# Altium schematic sheet MCU063A_Power.SchDoc
size 431 x 279 mm; Date: Not shown in title block; ApprovedBy: Not shown in title block; CheckedBy: Not shown in title block; Author: Not shown in title block; CompanyName: Not shown in title block; DrawnBy: Cody Watkins; Engineer: Not shown in title block; Organization: Not shown in title block; Address1: Not shown in title block; Address2: Not shown in title block; Address3: Not shown in title block; Address4: Not shown in title block; DocumentNumber: 5; Revision: Use project parameter SCH_Rev; SheetNumber: 5; SheetTotal: 11; PageSetup: Record=PageOptions|CenterHorizontal=True|CenterVertical=True|PrintScale=1.00|XCorrection=1.00|YCorrection=1.00|PrintKind=0|BorderSize=5000000|LeftOffset=0|BottomOffset=0|Orientation=2|PaperLength=1000|PaperWidth=1000|Scale=100|PaperSource=15|PrintQuality=600|MediaType=1|DitherType=10|PaperKind=Letter|PrintScaleMode=1; CurrentTime: Not shown in title block; CurrentDate: Not shown in title block; Time: Not shown in title block; DocumentFullPathAndName: Not shown in title block; DocumentName: Not shown in title block; ModifiedDate: Not shown in title block; ImagePath: Not shown in title block
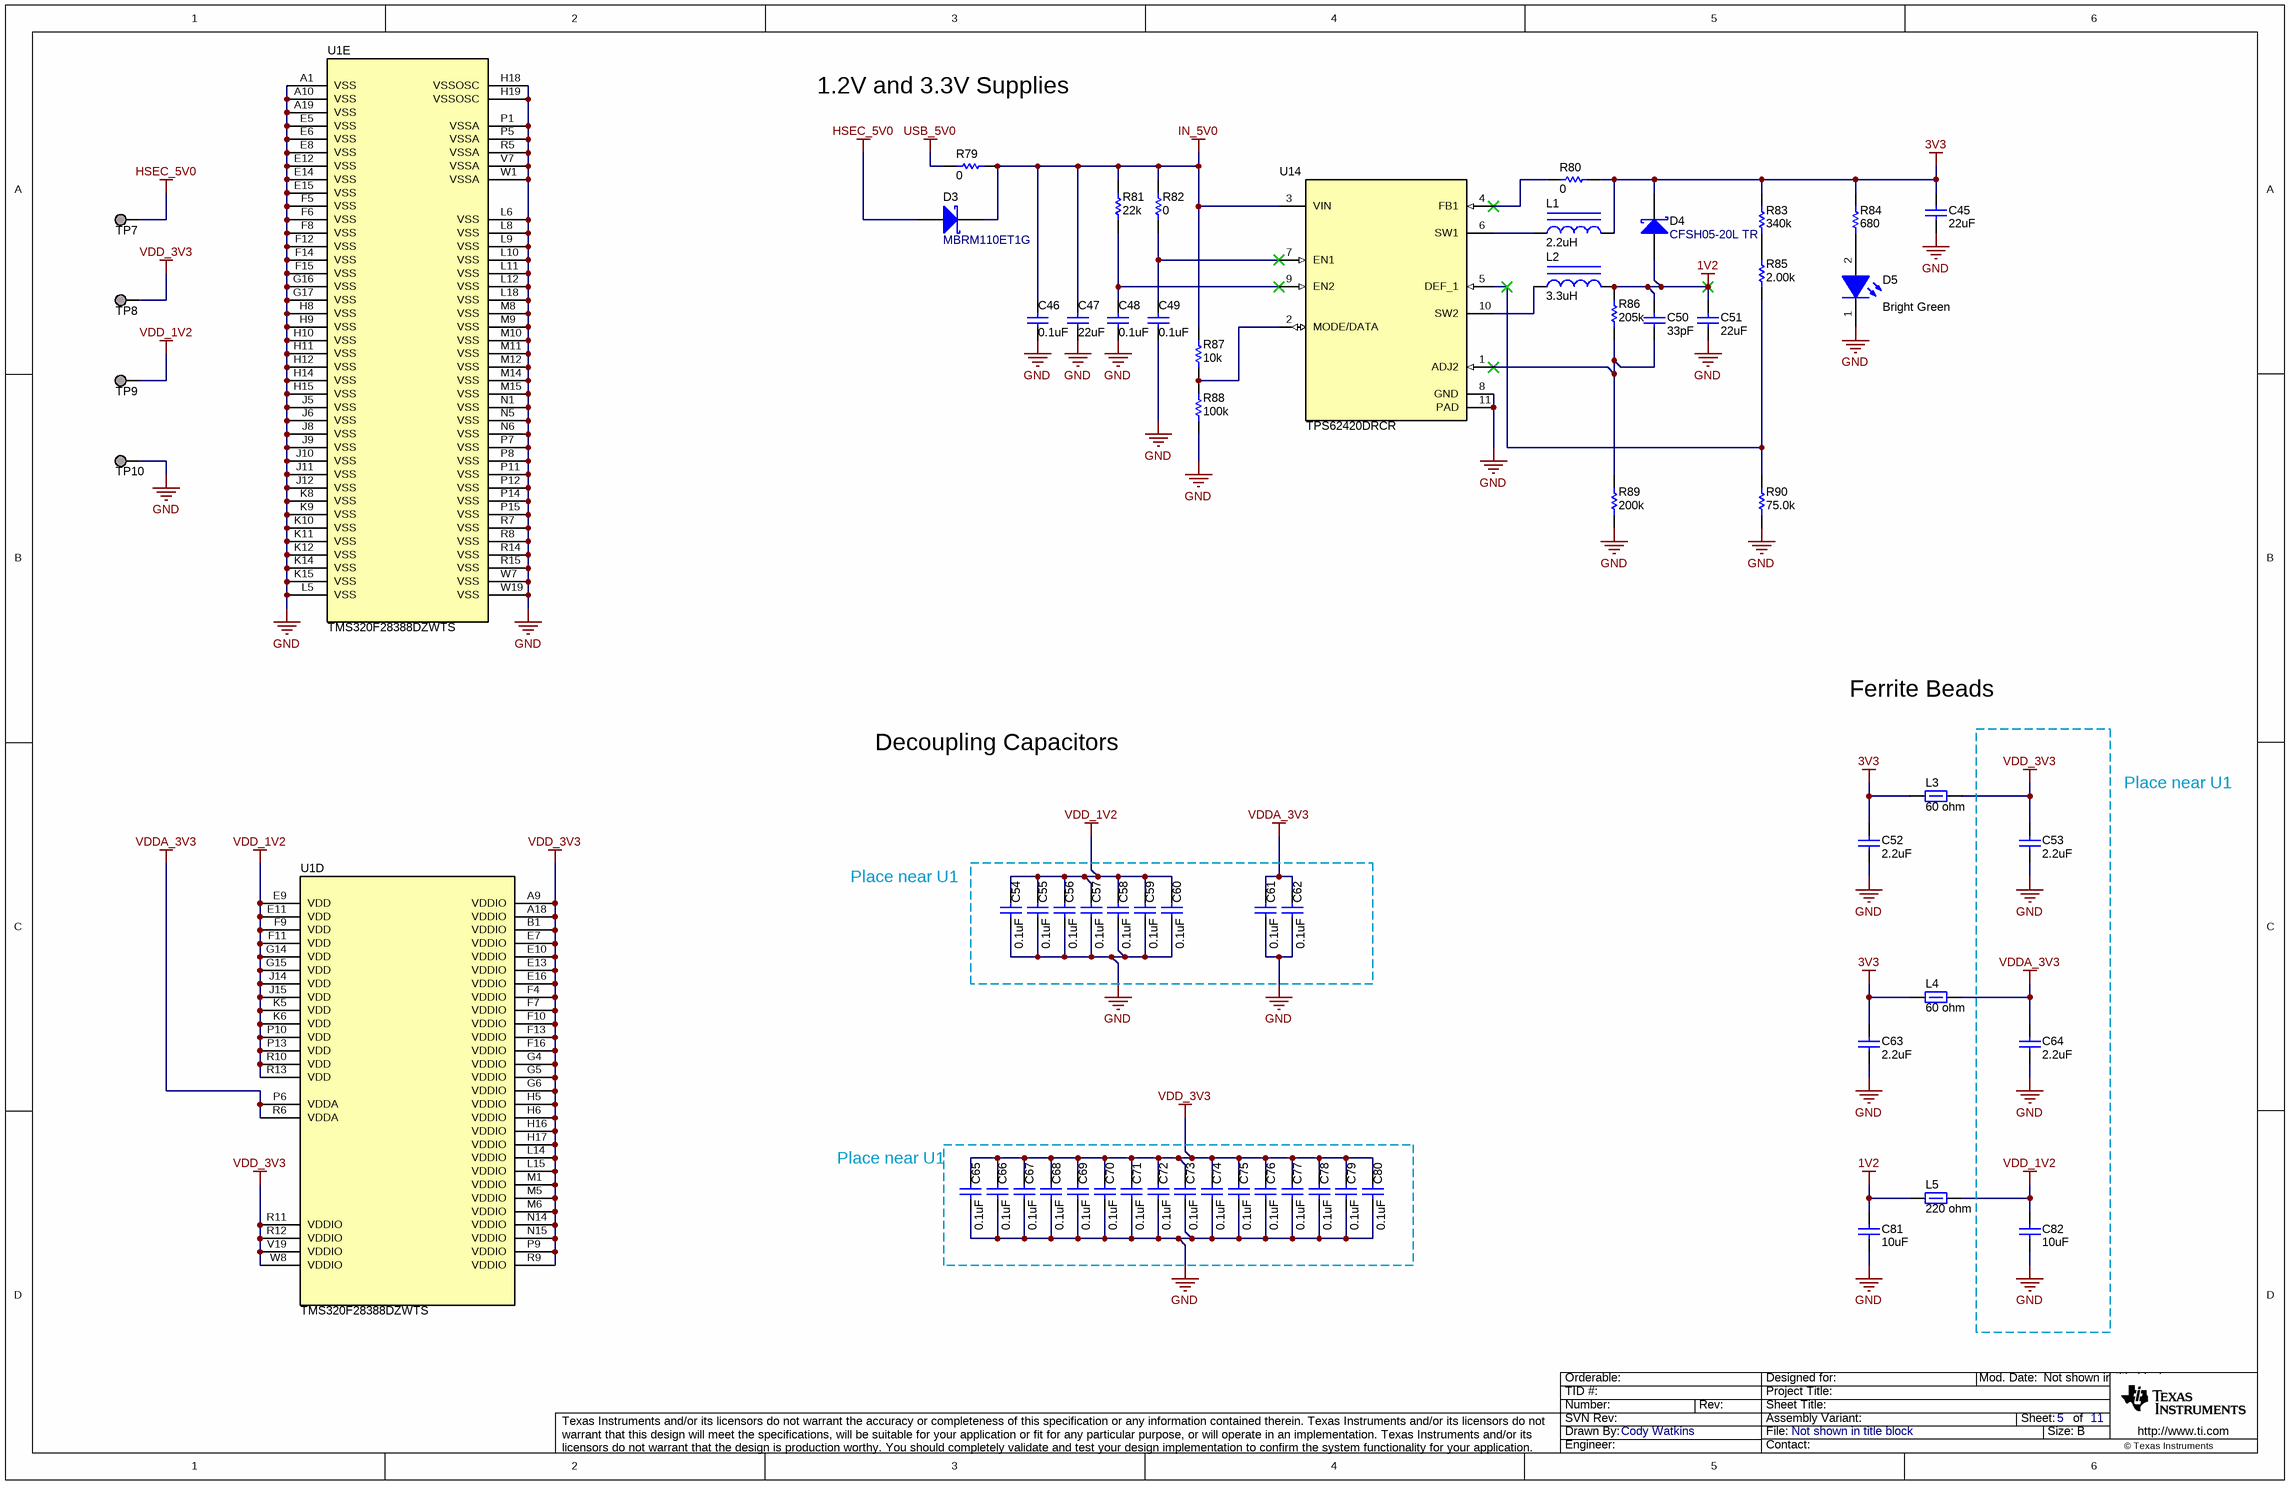
[diagram p0: MCU063A_Power.SchDoc]

## Parts
C45  ValueDisplayed: 22uF  [0805_HV]  (hidden comment: GRM21BR61C226ME44L)
C46  ValueDisplayed: 0.1uF  [0402]  (hidden comment: 0402YC104KAT2A)
C47  ValueDisplayed: 22uF  [0805_HV]  (hidden comment: GRM21BR61C226ME44L)
C48  ValueDisplayed: 0.1uF  [0402]  (hidden comment: 0402YC104KAT2A)
C49  ValueDisplayed: 0.1uF  [0402]  (hidden comment: 0402YC104KAT2A)
C50  ValueDisplayed: 33pF  [0402]  (hidden comment: 885012005043)
C51  ValueDisplayed: 22uF  [0805_HV]  (hidden comment: GRM21BR61C226ME44L)
C52  ValueDisplayed: 2.2uF  [0603]  (hidden comment: C0603C225K8PACTU)
C53  ValueDisplayed: 2.2uF  [0603]  (hidden comment: C0603C225K8PACTU)
C54  ValueDisplayed: 0.1uF  [0402]  (hidden comment: 0402YC104KAT2A)
C55  ValueDisplayed: 0.1uF  [0402]  (hidden comment: 0402YC104KAT2A)
C56  ValueDisplayed: 0.1uF  [0402L]  (hidden comment: 0402YC104KAT2A)
C57  ValueDisplayed: 0.1uF  [0402]  (hidden comment: 0402YC104KAT2A)
C58  ValueDisplayed: 0.1uF  [0402]  (hidden comment: 0402YC104KAT2A)
C59  ValueDisplayed: 0.1uF  [0402]  (hidden comment: 0402YC104KAT2A)
C60  ValueDisplayed: 0.1uF  [0402]  (hidden comment: 0402YC104KAT2A)
C61  ValueDisplayed: 0.1uF  [0402]  (hidden comment: 0402YC104KAT2A)
C62  ValueDisplayed: 0.1uF  [0402L]  (hidden comment: 0402YC104KAT2A)
C63  ValueDisplayed: 2.2uF  [0603]  (hidden comment: C0603C225K8PACTU)
C64  ValueDisplayed: 2.2uF  [0603]  (hidden comment: C0603C225K8PACTU)
C65  ValueDisplayed: 0.1uF  [0402]  (hidden comment: 0402YC104KAT2A)
C66  ValueDisplayed: 0.1uF  [0402]  (hidden comment: 0402YC104KAT2A)
C67  ValueDisplayed: 0.1uF  [0402]  (hidden comment: 0402YC104KAT2A)
C68  ValueDisplayed: 0.1uF  [0402]  (hidden comment: 0402YC104KAT2A)
C69  ValueDisplayed: 0.1uF  [0402]  (hidden comment: 0402YC104KAT2A)
C70  ValueDisplayed: 0.1uF  [0402]  (hidden comment: 0402YC104KAT2A)
C71  ValueDisplayed: 0.1uF  [0402]  (hidden comment: 0402YC104KAT2A)
C72  ValueDisplayed: 0.1uF  [0402]  (hidden comment: 0402YC104KAT2A)
C73  ValueDisplayed: 0.1uF  [0402]  (hidden comment: 0402YC104KAT2A)
C74  ValueDisplayed: 0.1uF  [0402]  (hidden comment: 0402YC104KAT2A)
C75  ValueDisplayed: 0.1uF  [0402]  (hidden comment: 0402YC104KAT2A)
C76  ValueDisplayed: 0.1uF  [0402]  (hidden comment: 0402YC104KAT2A)
C77  ValueDisplayed: 0.1uF  [0402]  (hidden comment: 0402YC104KAT2A)
C78  ValueDisplayed: 0.1uF  [0402]  (hidden comment: 0402YC104KAT2A)
C79  ValueDisplayed: 0.1uF  [0402]  (hidden comment: 0402YC104KAT2A)
C80  ValueDisplayed: 0.1uF  [0402]  (hidden comment: 0402YC104KAT2A)
C81  ValueDisplayed: 10uF  [0805_HV]  (hidden comment: C0805C106K8PACTU)
C82  ValueDisplayed: 10uF  [0603]  (hidden comment: GRM188R61A106ME69D)
D3  MBRM110ET1G  [POWERMITE]
D4  CFSH05-20L TR  [SOD-882L]
D5  value Bright Green  [WL-SMCW_Green_0805]  (hidden comment: 150080VS75000)
L1  ValueDisplayed: 2.2uH  [PFL3215]  (hidden comment: PFL3215-222MEB)
L2  ValueDisplayed: 3.3uH  [WE-MAIA_2510]  (hidden comment: 78438323033)
L3  value 60 ohm  [0805_HV]  (hidden comment: BKP2125HS600-T)
L4  value 60 ohm  [0805_HV]  (hidden comment: BKP2125HS600-T)
L5  value 220 ohm  [0805_HV]  (hidden comment: BLM21PG221SN1D)
R79  ValueDisplayed: 0  [0805_HV]  (hidden comment: MCR10EZPJ000)
R80  ValueDisplayed: 0  [0402]  (hidden comment: CRCW04020000Z0ED)
R81  ValueDisplayed: 22k  [0402]  (hidden comment: CRCW040222K0JNED)
R82  ValueDisplayed: 0  [0805_HV]  (hidden comment: MCR10EZPJ000)
R83  ValueDisplayed: 340k  [0402]  (hidden comment: CRCW0402340KFKED)
R84  ValueDisplayed: 680  [0402]  (hidden comment: CRCW0402680RJNED)
R85  ValueDisplayed: 2.00k  [0402]  (hidden comment: ERJ-2RKF2001X)
R86  ValueDisplayed: 205k  [0402]  (hidden comment: CRCW0402205KFKED)
R87  ValueDisplayed: 10k  [0402]  (hidden comment: CRCW040210K0JNED)
R88  ValueDisplayed: 100k  [0603]  (hidden comment: CRCW0603100KJNEA)
R89  ValueDisplayed: 200k  [0402]  (hidden comment: ERJ-2RKF2003X)
R90  ValueDisplayed: 75.0k  [0603]  (hidden comment: RT0603DRE0775KL)
TP7  TESTPOINT  [TP_50MIL-25MILHOLE]  (value not drawn)  (no BOM)
TP8  TESTPOINT  [TP_50MIL-25MILHOLE]  (value not drawn)  (no BOM)
TP9  TESTPOINT  [TP_50MIL-25MILHOLE]  (value not drawn)  (no BOM)
TP10  TESTPOINT  [TP_50MIL-25MILHOLE]  (value not drawn)  (no BOM)
U1  TMS320F28388DZWTS  [ZWT0337A]  (parts D,E of 5)
U14  TPS62420DRCR  [DRC0010J]

## Nets
1V2: C50.1 C51.1 C81.2 D4.2(A) L2.2 L5.1 R86.2
3V3: C45.1 C52.2 C63.2 D4.1(K) L1.2 L3.1 L4.1 R80.1 R83.2 R84.2
GND: C45.2 C46.2 C47.2 C48.2 C49.1 C51.2 C52.1 C53.1 C54.2 C55.2 C56.2 C57.2 C58.2 C59.2 C60.2 C61.2 C62.2 C63.1 C64.1 C65.2 C66.2 C67.2 C68.2 C69.2 C70.2 C71.2 C72.2 C73.2 C74.2 C75.2 C76.2 C77.2 C78.2 C79.2 C80.2 C81.1 C82.2 D5.1(K) R88.1 R89.1 R90.1 TP10.1 U1.A1(VSS) U1.A10(VSS) U1.A19(VSS) U1.E5(VSS) U1.E6(VSS) U1.E8(VSS) U1.E12(VSS) U1.E14(VSS) U1.E15(VSS) U1.F5(VSS) U1.F6(VSS) U1.F8(VSS) U1.F12(VSS) U1.F14(VSS) U1.F15(VSS) U1.G16(VSS) U1.G17(VSS) U1.H8(VSS) U1.H9(VSS) U1.H10(VSS) U1.H11(VSS) U1.H12(VSS) U1.H14(VSS) U1.H15(VSS) U1.H18(VSSOSC) U1.H19(VSSOSC) U1.J5(VSS) U1.J6(VSS) U1.J8(VSS) U1.J9(VSS) U1.J10(VSS) U1.J11(VSS) U1.J12(VSS) U1.K8(VSS) U1.K9(VSS) U1.K10(VSS) U1.K11(VSS) U1.K12(VSS) U1.K14(VSS) U1.K15(VSS) U1.L5(VSS) U1.L6(VSS) U1.L8(VSS) U1.L9(VSS) U1.L10(VSS) U1.L11(VSS) U1.L12(VSS) U1.L18(VSS) U1.M8(VSS) U1.M9(VSS) U1.M10(VSS) U1.M11(VSS) U1.M12(VSS) U1.M14(VSS) U1.M15(VSS) U1.N1(VSS) U1.N5(VSS) U1.N6(VSS) U1.P1(VSSA) U1.P5(VSSA) U1.P7(VSS) U1.P8(VSS) U1.P11(VSS) U1.P12(VSS) U1.P14(VSS) U1.P15(VSS) U1.R5(VSSA) U1.R7(VSS) U1.R8(VSS) U1.R14(VSS) U1.R15(VSS) U1.V7(VSSA) U1.W1(VSSA) U1.W7(VSS) U1.W19(VSS) U14.8(GND) U14.11(PAD)
HSEC_5V0: D3.2(A) TP7.1
IN_5V0: C46.1 C47.1 D3.1(K) R79.1 R81.2 R82.1 R87.2 U14.3(VIN)
USB_5V0: R79.2
VDD_1V2: C54.1 C55.1 C56.1 C57.1 C58.1 C59.1 C60.1 C82.1 L5.2 TP9.1 U1.E9(VDD) U1.E11(VDD) U1.F9(VDD) U1.F11(VDD) U1.G14(VDD) U1.G15(VDD) U1.J14(VDD) U1.J15(VDD) U1.K5(VDD) U1.K6(VDD) U1.P10(VDD) U1.P13(VDD) U1.R10(VDD) U1.R13(VDD)
VDD_3V3: C53.2 C65.1 C66.1 C67.1 C68.1 C69.1 C70.1 C71.1 C72.1 C73.1 C74.1 C75.1 C76.1 C77.1 C78.1 C79.1 C80.1 L3.2 TP8.1 U1.A9(VDDIO) U1.A18(VDDIO) U1.B1(VDDIO) U1.E7(VDDIO) U1.E10(VDDIO) U1.E13(VDDIO) U1.E16(VDDIO) U1.F4(VDDIO) U1.F7(VDDIO) U1.F10(VDDIO) U1.F13(VDDIO) U1.F16(VDDIO) U1.G4(VDDIO) U1.G5(VDDIO) U1.G6(VDDIO) U1.H5(VDDIO) U1.H6(VDDIO) U1.H16(VDDIO) U1.H17(VDDIO) U1.L14(VDDIO) U1.L15(VDDIO) U1.M1(VDDIO) U1.M5(VDDIO) U1.M6(VDDIO) U1.N14(VDDIO) U1.N15(VDDIO) U1.P9(VDDIO) U1.R9(VDDIO) U1.R11(VDDIO) U1.R12(VDDIO) U1.V19(VDDIO) U1.W8(VDDIO)
VDDA_3V3: C61.1 C62.1 C64.2 L4.2 U1.P6(VDDA) U1.R6(VDDA)
NetC48_1: C48.1 R81.1 U14.9(EN2)
NetC49_2: C49.2 R82.2 U14.7(EN1)
NetC50_2: C50.2 R86.1 R89.2 U14.1(ADJ2)
NetD5_2: D5.2(A) R84.1
NetL1_1: L1.1 U14.6(SW1)
NetL2_1: L2.1 U14.10(SW2)
NetR80_2: R80.2 U14.4(FB1)
NetR83_1: R83.1 R85.2
NetR85_1: R85.1 R90.2 U14.5(DEF_1)
NetR87_1: R87.1 R88.2 U14.2(MODE/DATA)

## Notes on the sheet
- 1.2V and 3.3V Supplies
- Ferrite Beads
- Decoupling Capacitors
- Place near U1
- (near C65) Place near U1
- Drawn By:
- SVN Rev:
- Number:
- TID #:
- Orderable:
- Rev:
- Sheet Title:
- File:
- Project Title:
- Designed for:
- Assembly Variant:
- Mod. Date:
- Sheet:
- Size:
- of
- B
- http://www.ti.com
- Texas Instruments and/or its licensors do not warrant the accuracy or completeness of this specification or any information contained therein. Texas Instruments and/or its licensors do not warrant that this design will meet the specifications, will be suitable for your application or fit for any particular purpose, or will operate in an implementation. Texas Instruments and/or its licensors do not warrant that the design is production worthy. You should completely validate and test your design implementation to confirm the system functionality for your application.
- Engineer:
- Contact:
- © Texas Instruments

## Library data of the parts
C45 C47 C51 = CMP-0008294-2: CAP, CERM, 22 uF, 16 V, +/- 20%, X5R, 0805; Manufacturer: MuRata; TaMin_C: -55°C; Polarized: N; SizeAreaWB_mm2: 6.75; Value1: Unknown; U/M: EA; Value: 22uF; TaMax_C: 85°C; SizeZ_mm: 1.45; SizeX_mm: 2; SizeY_mm: 1.25; Cap_Case: 0805; Value2: 16V; SizeArea_mm2: 2.5; Cap_F: 22µF; AEC Category: Q200; Supplier Part Number 2: 81-GRM21BR61C226ME4L; Publisher: Texas Instruments; Supplier 2: Mouser; TempCo: X5R; Published: 2008-06-19; RoHS: Y; MountType: SMT; Supplier 1: Digi-Key; PackageReference: 0805; Tolerance_%: 20%; CompType: Capacitor; LatestRevisionDate: 2017-03-09; PartNumber: GRM21BR61C226ME44L; AEC Qualified: N; ComponentLink1Description: Datasheet link; AEC Grade: N/A; Supplier Part Number 1: 490-10747-1-ND; Technology: Ceramic; ComponentLink1URL: http://search.murata.co.jp/Ceramy/image/img/A01X/G101/ENG/GRM21BR61C226ME44-01.pdf
C46 C48 C49 C54 C55 C57-C61 C65-C80 = CMP-0006201-2: CAP, CERM, 0.1 uF, 16 V, +/- 10%, X7R, 0402; Manufacturer: AVX; TaMin_C: -55°C; Polarized: N; SizeAreaWB_mm2: 3; Value1: Unknown; U/M: EA; Value: 0.1uF; TaMax_C: 125°C; SizeZ_mm: 0.6; SizeX_mm: 1; SizeY_mm: 0.5; Value2: 16V; Cap_F: 100nF; AEC Category: Q200; Supplier Part Number 2: 09R7024; Publisher: Texas Instruments; Supplier 2: Newark; Supplier Part Number 3: 581-0402YC104KAT2A; TempCo: X7R; Supplier 3: Mouser; Published: 2008-06-19; RoHS: Y; MountType: SMT; Supplier 1: Digi-Key; PackageReference: 0402; Tolerance_%: 10%; Cap_Case: 0402; SizeArea_mm2: 0.5; CompType: Capacitor; LatestRevisionDate: 2017-03-09; PartNumber: 0402YC104KAT2A; AEC Qualified: N; ComponentLink1Description: Datasheet link; AEC Grade: N/A; Supplier Part Number 1: 478-7888-1-ND; Technology: Ceramic; ComponentLink1URL: http://catalogs.avx.com/SurfaceMount.pdf
C50 = CMP-0006213-2: CAP, CERM, 33 pF, 25 V, +/- 5%, C0G/NP0, 0402; Manufacturer: Wurth Elektronik; TaMin_C: -55°C; Polarized: N; SizeAreaWB_mm2: 3; Value1: Unknown; U/M: EA; Value: 33pF; TaMax_C: 125°C; SizeZ_mm: 0.6; SizeX_mm: 1; SizeY_mm: 0.5; Value2: 25V; AEC Category: Q200; Publisher: Texas Instruments; TempCo: C0G/NP0; Published: 2008-06-19; RoHS: Y; MountType: SMT; Supplier 1: Mouser; PackageReference: 0402; Tolerance_%: 5%; Cap_Case: 0402; SizeArea_mm2: 0.5; CompType: Capacitor; LatestRevisionDate: 2017-03-09; PartNumber: 885012005043; AEC Qualified: N; Cap_F: 33pF; ComponentLink1Description: Datasheet link; Supplier Part Number 1: 710-885012005043; Technology: Ceramic; ComponentLink1URL: http://katalog.we-online.de/pbs/datasheet/885012005043.pdf; AEC Grade: N/A; VDC_V: 25V
C52 C53 C63 C64 = CMP-0006906-5: CAP, CERM, 2.2 uF, 10 V, +/- 10%, X5R, 0603; Manufacturer: Kemet; TaMin_C: -55°C; Polarized: N; SizeAreaWB_mm2: 4.68; Value1: Unknown; U/M: EA; Value: 2.2uF; TaMax_C: 85°C; SizeZ_mm: 1; SizeX_mm: 1.6; SizeY_mm: 0.8; Value2: 10V; SizeArea_mm2: 1.28; Cap_F: 2.2µF; AEC Category: Q200; Supplier Part Number 2: 80-C0603C225K8P; Publisher: Texas Instruments; Supplier 2: Mouser; Supplier Part Number 3: 1108322; TempCo: X5R; Supplier 3: Farnell; Published: 2008-06-19; RoHS: Y; MountType: SMT; Supplier 1: Digi-Key; PackageReference: 0603; Tolerance_%: 10%; Cap_Case: 0603; CompType: Capacitor; LatestRevisionDate: 2017-03-09; PartNumber: C0603C225K8PACTU; AEC Qualified: ?; ComponentLink1Description: Datasheet link; Supplier Part Number 1: 399-4911-1-ND; Technology: Ceramic; ComponentLink1URL: http://www.kemet.com/kemet/web/homepage/kechome.nsf/vapubfiles/F3102_Y5V.pdf/$file/F3102_Y5V.pdf
C56 C62 = CMP-0006201-2: CAP, CERM, 0.1 uF, 16 V, +/- 10%, X7R, 0402; Manufacturer: AVX; TaMin_C: -55°C; Polarized: N; SizeAreaWB_mm2: 3; Value1: Unknown; U/M: EA; Value: 0.1uF; TaMax_C: 125°C; SizeZ_mm: 0.6; SizeX_mm: 1; SizeY_mm: 0.5; Cap_Case: 0402; Value2: 16V; Cap_F: 100nF; AEC Category: Q200; Supplier Part Number 2: 09R7024; Publisher: Texas Instruments; Supplier 2: Newark; Supplier Part Number 3: 581-0402YC104KAT2A; TempCo: X7R; Supplier 3: Mouser; Published: 2008-06-19; RoHS: Y; MountType: SMT; Supplier 1: Digi-Key; PackageReference: 0402; Tolerance_%: 10%; SizeArea_mm2: 0.5; CompType: Capacitor; LatestRevisionDate: 2017-03-09; PartNumber: 0402YC104KAT2A; AEC Qualified: N; ComponentLink1Description: Datasheet link; AEC Grade: N/A; Supplier Part Number 1: 478-7888-1-ND; Technology: Ceramic; ComponentLink1URL: http://catalogs.avx.com/SurfaceMount.pdf
C81 = CMP-0007732-2: CAP, CERM, 10 uF, 10 V, +/- 10%, X5R, 0805; Manufacturer: Kemet; TaMin_C: -55°C; ESR_ohm: 3m; Polarized: N; SizeAreaWB_mm2: 6.75; Value1: 0.003 ohm; U/M: EA; Value: 10uF; TaMax_C: 85°C; SizeZ_mm: 1.45; SizeX_mm: 2; SizeY_mm: 1.25; Cap_Case: 0805; Value2: 10V; SizeArea_mm2: 2.5; Cap_F: 10µF; IRMS_A: 11.43A; AEC Category: Q200; Supplier Part Number 2: 70K9138; Publisher: Texas Instruments; Supplier 2: Newark; Supplier Part Number 3: 80-C0805C106K8P; TempCo: X5R; Supplier 3: Mouser; Published: 2008-06-19; RoHS: Y; MountType: SMT; Supplier 1: Digi-Key; PackageReference: 0805; Tolerance_%: 10%; CompType: Capacitor; LatestRevisionDate: 2017-03-09; PartNumber: C0805C106K8PACTU; AEC Qualified: ?; ComponentLink1Description: Datasheet link; Supplier Part Number 1: 399-4925-1-ND; Technology: Ceramic; ComponentLink1URL: http://www.kemet.com/kemet/web/homepage/kechome.nsf/file/Partial%20Copy%20-%20Ceramic%20Surface%20Mount%20Capacitors/$file/F3102_CE.pdf
C82 = CMP-0007318-5: CAP, CERM, 10 uF, 10 V, +/- 20%, X5R, 0603; Manufacturer: MuRata; Polarized: N; Value: 10uF; U/M: EA; Cap_F: 10µF; Value1: Unknown; VDC_V: 10V; TaMin_C: -55°C; TaMax_C: 85°C; AEC Category: Q200; SizeArea_mm2: 1.28; SizeAreaWB_mm2: 4.68; SizeX_mm: 1.6; SizeY_mm: 0.8; SizeZ_mm: 1; CompType: Capacitor; PartNumber: GRM188R61A106ME69D; PackageReference: 0603; RoHS: Y; Tolerance_%: 20%; Value2: 10V; MountType: SMT; Technology: Ceramic; TempCo: X5R; Cap_Case: 0603; Published: 2008-06-19; Publisher: Texas Instruments; LatestRevisionDate: 2017-03-09; ComponentLink1Description: Datasheet link; ComponentLink1URL: http://psearch.murata.com/capacitor/product/GRM188R61A106ME69%23.pdf; AEC Qualified: ?
D3 = CMP-0028747-2: Diode, Schottky, 10 V, 1 A, AEC-Q101, POWERMITE; Manufacturer: ON Semiconductor; Vf_V: 530mV; Value: 10V; Green_REACh: Incomplete; Io_A: 1A; SizeZ_mm: 1.15; AEC Category: Q101; SizeX_mm: 3.9; AEC Qualified: Y; Value2: 0.53V; SizeAreaWB_mm2: 14.945; SizeArea_mm2: 7.995; TJmax_C: 150°C; Green_Lifecycle: Not Set; SizeY_mm: 2.05; ComponentLink1Description: Datasheet link; Vr_V: 10V; MountType: SMT; Value1: 1A; PartNumber: MBRM110ET1G; PackageReference: POWERMITE; CompType: Diode; Green_EU RoHS: Incomplete; Green_EU RoHS-2: Incomplete; ComponentLink1URL: http://www.onsemi.com/pub_link/Collateral/MBRM110E-D.PDF; RoHS: Y; Type: Schottky
D4 = CMP-0028751-2: Diode, Schottky, 20 V, 0.5 A, 1.0x0.35x0.6mm; Manufacturer: Central Semiconductor; Io_A: 500mA; Green_Lifecycle: Not Set; SizeAreaWB_mm2: 3.2; Vr_V: 20V; Green_REACh: Incomplete; Value1: 0.5A; TJmax_C: 150°C; Value: 20V; SizeZ_mm: 0.4; SizeX_mm: 1; SizeY_mm: 0.6; Vf_V: 500mV; Value2: 0.5V; AEC Qualified: N; AEC Category: Q101; ComponentLink1URL: http://www.centralsemi.com/PDFs/products/CFSH05-20L.PDF; RoHS: Y; MountType: SMT; Green_EU RoHS-2: Incomplete; Green_EU RoHS: Incomplete; PackageReference: 1.0x0.35x0.6mm; SizeArea_mm2: 0.6; CompType: Diode; Type: Schottky; PartNumber: CFSH05-20L TR; ComponentLink1Description: Datasheet link
D5 = CMP-0002960-2: LED, Bright Green, SMD; Manufacturer: Wurth Elektronik; Type: AlInGaP; Vf_V: 2V; Io_A: 20mA; Vr_V: 5V; Tjmax_C: 85°C; Power_TotalModule: 72mW; Value1: 0.072W; Angle: 140; U/M: EA; PartNumber: 150080VS75000; PackageReference: LED_0805; RoHS: Y; CompType: LED; MountType: SMT; Value2: 2V; Color: Bright Green; Published: 2008-07-11; Publisher: Texas Instruments; ComponentLink1URL: http://katalog.we-online.de/led/datasheet/150080VS75000.pdf; ComponentLink1Description: Datasheet link; LatestRevisionDate: 2017-03-09; Supplier 1: Digi-Key; Supplier Part Number 1: 732-4986-1-ND; Supplier 2: Newark; Supplier Part Number 2: 95W3803; Supplier 3: Mouser; Supplier Part Number 3: 710-150080VS75000
L1 = CMP-0060725-1: Inductor, Shielded, Composite, 2.2 uH, 1.1 A, 0.114 ohm, SMD; Manufacturer: Coilcraft; Isat: 1.2A @ 20% inductance drop; Irms: 1.1A @ 20C rise; Green_Lifecycle: Not Set; SizeAreaWB_mm2: 13.8012; DCR_ohm: 1.14d; Green_REACh: Incomplete; Value: 2.2uH; Imax_A: 1.1A; SizeZ_mm: 1.5; SizeX_mm: 3.2; SizeY_mm: 2.286; SizeArea_mm2: 7.3152; Ind_H: 2.2µH; AEC Category: Q200; ComponentLink1URL: http://www.coilcraft.com/pdfs/pfl3215.pdf; Supplier Part Number 2: 2288767; Publisher: Texas Instruments; Supplier 2: Farnell; Published: 2008-06-26; RoHS: Y; Value1: 0.114 ohm; Material: Composite; MountType: SMT; Green_EU RoHS-2: Incomplete; Supplier 1: Mouser; Green_EU RoHS: Incomplete; PackageReference: 3.2x1.5x2.286mm; Value2: 1.1A; CompType: Inductor; LatestRevisionDate: 2017-06-02; PartNumber: PFL3215-222MEB; AEC Qualified: ?; ComponentLink1Description: Datasheet link; Supplier Part Number 1: 994-PFL3215-222MEB; Technology: Shielded
L2 = CMP-0064350-1: Inductor, Shielded, Powdered Iron, 3.3 uH, 1.25 A, 0.264 ohm, AEC-Q200 Grade 1, SMD; Manufacturer: Wurth Elektronik; Isat: 2.1A @ 20% inductance drop; Irms: 1.25A @ 40C rise; SizeAreaWB_mm2: 10.5; DCR_ohm: 2.64d; Value: 3.3uH; Imax_A: 1.25A; SizeZ_mm: 1; SizeX_mm: 2.5; SizeY_mm: 2; SizeArea_mm2: 5; Ind_H: 3.3µH; AEC Qualified: Y; AEC Category: Q200; ComponentLink1URL: http://katalog.we-online.de/pbs/datasheet/78438323033.pdf; Publisher: Texas Instruments; Published: 2008-06-26; RoHS: Y; Value1: 0.264 ohm; Material: Powdered Iron; MountType: SMT; Supplier 1: Digi-Key; PackageReference: 2.5x1.0x2.0mm; Value2: 1.25A; CompType: Inductor; LatestRevisionDate: 2017-06-02; PartNumber: 78438323033; ComponentLink1Description: Datasheet link; AEC Grade: 1; Supplier Part Number 1: 732-6915-1-ND; Technology: Shielded
L3 L4 = CMP-0003306-1: Ferrite Bead, 60 ohm @ 100 MHz, 3 A, 0805; Manufacturer: Taiyo Yuden; Imax_A: 3A; DCR_ohm: 0.025; Value1: 0.025 ohm; ZTyp@100MHz_Ohm: 60; SizeArea_mm2: 2.5; SizeAreaWB_mm2: 6.75; SizeX_mm: 2; SizeY_mm: 1.25; SizeZ_mm: 1.45; CompType: Ferrite Bead; PartNumber: BKP2125HS600-T; Value2: 3A; MountType: SMT; PackageReference: 0805; Published: 2014-04-30; Publisher: Texas Instruments; LatestRevisionDate: 2017-03-09; ComponentLink1Description: Datasheet link; ComponentLink1URL: http://www.yuden.co.jp/productdata/catalog/en/mlci08_e.pdf; RoHS: Y; Supplier 1: Digi-Key; Supplier Part Number 1: 587-1932-1-ND; Supplier 2: Newark; Supplier Part Number 2: 30K5394 LF BKP2125HS600-T; Supplier 3: Mouser; Supplier Part Number 3: 963-BKP2125HS600-T; ValueDisplayed: 60 ohm
L5 = CMP-0003363-1: Ferrite Bead, 220 ohm @ 100 MHz, 2 A, 0805; Manufacturer: MuRata; Imax_A: 2A; DCR_ohm: 0.045; Value1: 0.045 ohm; ZTyp@100MHz_Ohm: 220; SizeArea_mm2: 2.5; SizeAreaWB_mm2: 6.75; SizeX_mm: 2; SizeY_mm: 1.25; SizeZ_mm: 1.45; CompType: Ferrite Bead; PartNumber: BLM21PG221SN1D; Value2: 2A; MountType: SMT; PackageReference: 0805; Published: 2014-04-30; Publisher: Texas Instruments; LatestRevisionDate: 2017-03-09; ComponentLink1Description: Datasheet link; ComponentLink1URL: http://search.murata.co.jp/Ceramy/image/img/PDF/ENG/L0110S0100BLM21P.pdf; RoHS: Y; Supplier 1: Digi-Key; Supplier Part Number 1: 490-1054-1-ND; Supplier 2: Newark; Supplier Part Number 2: 73M9167; Supplier 3: Mouser; Supplier Part Number 3: 81-BLM21P221SG; ValueDisplayed: 220 ohm
R79 R82 = CMP-0020802-2: RES, 0, 5%, 0.125 W, 0805; Manufacturer: Rohm; Power_W: 125mW; TempCo: 400 ppm/C; Value_Code: 0000; U/M: EA; Value: 0; EIA_Code: E24; SizeX_mm: 2; SizeY_mm: 1.25; SizeZ_mm: 1.45; Value2: 0.125W; SizeArea_mm2: 2.5; VDC_V: 150V; AEC Category: Q200; Publisher: Texas Instruments; Published: 2008-06-26; RoHS: Y; Value1: 5%; MountType: SMT; Supplier 1: Digi-Key; PackageReference: 0805; Tolerance_%: 5%; Res_ohm: 0; CompType: Resistor; LatestRevisionDate: 2017-03-09; PartNumber: MCR10EZPJ000; AEC Qualified: ?; ComponentLink1Description: Datasheet link; Supplier Part Number 1: RHM0.0ARCT-ND; Technology: Thick Film; ComponentLink1URL: http://www.rohm.com/products/databook/r/pdf/mcr10.pdf
R80 = CMP-0026822-3: RES, 0, 5%, 0.063 W, AEC-Q200 Grade 0, 0402; Manufacturer: Vishay-Dale; Power_W: 63mW; TempCo: 200 ppm/C; Value_Code: 0000; Value: 0; EIA_Code: E24; SizeX_mm: 1; SizeY_mm: 0.5; SizeZ_mm: 0.6; Value2: 0.063W; AEC Qualified: Y; VDC_V: 50V; AEC Category: Q200; Supplier Part Number 2: 52K6543; Supplier 2: Newark; Supplier Part Number 3: 71-CRCW0402-0-E3; Supplier 3: Mouser; RoHS: E; Value1: 5%; MountType: SMT; Supplier 1: Digi-Key; PackageReference: 0402; Tolerance_%: 5%; Res_ohm: 0; SizeArea_mm2: 0.5; CompType: Resistor; PartNumber: CRCW04020000Z0ED; ComponentLink1Description: Datasheet link; Supplier Part Number 1: 541-0.0JCT-ND; Technology: Thick Film; ComponentLink1URL: http://www.vishay.com/docs/20035/dcrcwe3.pdf; AEC Grade: 0
R81 = CMP-0026879-3: RES, 22 k, 5%, 0.063 W, AEC-Q200 Grade 0, 0402; Manufacturer: Vishay-Dale; Power_W: 63mW; TempCo: 200 ppm/C; Value_Code: 22k0; Value: 22k; EIA_Code: E24; SizeX_mm: 1; SizeY_mm: 0.5; SizeZ_mm: 0.6; Value2: 0.063W; AEC Qualified: Y; VDC_V: 50V; AEC Category: Q200; AEC Grade: 0; Supplier Part Number 2: 59M6715; Supplier 2: Newark; Supplier Part Number 3: 71-CRCW0402J-22K-E3; Supplier 3: Mouser; RoHS: E; Value1: 5%; MountType: SMT; Supplier 1: Digi-Key; PackageReference: 0402; Tolerance_%: 5%; Res_ohm: 22k; SizeArea_mm2: 0.5; CompType: Resistor; PartNumber: CRCW040222K0JNED; ComponentLink1Description: Datasheet link; Supplier Part Number 1: 541-22KJCT-ND; Technology: Thick Film; ComponentLink1URL: http://www.vishay.com/docs/20035/dcrcwe3.pdf
R83 = CMP-0026300-2: RES, 340 k, 1%, 0.063 W, AEC-Q200 Grade 0, 0402; Manufacturer: Vishay-Dale; Power_W: 63mW; TempCo: 100 ppm/C; Value: 340k; EIA_Code: E96; SizeX_mm: 1; SizeY_mm: 0.5; SizeZ_mm: 0.6; Value2: 0.063W; AEC Qualified: Y; VDC_V: 50V; AEC Category: Q200; AEC Grade: 0; ComponentLink1URL: http://www.vishay.com/docs/20035/dcrcwe3.pdf; Supplier Part Number 2: 52K6992; Supplier 2: Newark; Supplier Part Number 3: 71-CRCW0402-340K-E3; Supplier 3: Mouser; Value_Code: 340k; RoHS: E; Value1: 1%; MountType: SMT; Supplier 1: Digi-Key; PackageReference: 0402; Tolerance_%: 1%; Res_ohm: 340k; SizeArea_mm2: 0.5; CompType: Resistor; PartNumber: CRCW0402340KFKED; ComponentLink1Description: Datasheet link; Supplier Part Number 1: 541-340KLCT-ND; Technology: Thick Film
R84 = CMP-0026962-3: RES, 680, 5%, 0.063 W, AEC-Q200 Grade 0, 0402; Manufacturer: Vishay-Dale; Power_W: 63mW; TempCo: 200 ppm/C; Value_Code: 680R; Value: 680; EIA_Code: E24; SizeX_mm: 1; SizeY_mm: 0.5; SizeZ_mm: 0.6; Value2: 0.063W; AEC Qualified: Y; VDC_V: 50V; AEC Category: Q200; AEC Grade: 0; Supplier Part Number 2: 59M6744; Supplier 2: Newark; Supplier Part Number 3: 71-CRCW0402J-680-E3; Supplier 3: Mouser; RoHS: E; Value1: 5%; MountType: SMT; Supplier 1: Digi-Key; PackageReference: 0402; Tolerance_%: 5%; Res_ohm: 680; SizeArea_mm2: 0.5; CompType: Resistor; PartNumber: CRCW0402680RJNED; ComponentLink1Description: Datasheet link; Supplier Part Number 1: 541-680JCT-ND; Technology: Thick Film; ComponentLink1URL: http://www.vishay.com/docs/20035/dcrcwe3.pdf
R85 = CMP-0026676-1: RES, 2.00 k, 1%, 0.1 W, AEC-Q200 Grade 0, 0402; Manufacturer: Panasonic; Power_W: 100mW; TempCo: 100 ppm/C; Value_Code: 2k00; U/M: EA; Value: 2.00k; EIA_Code: E96; Res_ohm: 2k; SizeX_mm: 1; SizeY_mm: 0.5; SizeZ_mm: 0.6; Value2: 0.1W; AEC Qualified: Y; VDC_V: 50V; AEC Grade: 0; AEC Category: Q200; ComponentLink1URL: http://industrial.panasonic.com/cdbs/www-data/pdf/RDA0000/AOA0000C86.pdf; Supplier Part Number 2: 73T6486; Publisher: Texas Instruments; Supplier 2: Newark; Supplier Part Number 3: 667-ERJ-2RKF2001X; Supplier 3: Mouser; Published: 2008-06-26; RoHS: Y; Value1: 1%; MountType: SMT; Supplier 1: Digi-Key; PackageReference: 0402; Tolerance_%: 1%; SizeArea_mm2: 0.5; CompType: Resistor; LatestRevisionDate: 2017-03-09; PartNumber: ERJ-2RKF2001X; ComponentLink1Description: Datasheet link; Supplier Part Number 1: P2.00KLCT-ND; Technology: Thick Film
R86 = CMP-0026160-2: RES, 205 k, 1%, 0.063 W, AEC-Q200 Grade 0, 0402; Manufacturer: Vishay-Dale; Power_W: 63mW; TempCo: 100 ppm/C; Value: 205k; EIA_Code: E96; SizeX_mm: 1; SizeY_mm: 0.5; SizeZ_mm: 0.6; Value2: 0.063W; AEC Qualified: Y; VDC_V: 50V; AEC Category: Q200; AEC Grade: 0; ComponentLink1URL: http://www.vishay.com/docs/20035/dcrcwe3.pdf; Supplier Part Number 2: 52K6827; Supplier 2: Newark; Supplier Part Number 3: 71-CRCW0402-205K-E3; Supplier 3: Mouser; Value_Code: 205k; RoHS: E; Value1: 1%; MountType: SMT; Supplier 1: Digi-Key; PackageReference: 0402; Tolerance_%: 1%; Res_ohm: 205k; SizeArea_mm2: 0.5; CompType: Resistor; PartNumber: CRCW0402205KFKED; ComponentLink1Description: Datasheet link; Supplier Part Number 1: 541-205KLCT-ND; Technology: Thick Film
R87 = CMP-0026825-5: RES, 10 k, 5%, 0.063 W, AEC-Q200 Grade 0, 0402; Manufacturer: Vishay-Dale; Power_W: 63mW; TempCo: 200 ppm/C; Value_Code: 10k0; Value: 10k; EIA_Code: E24; SizeX_mm: 1; SizeY_mm: 0.5; SizeZ_mm: 0.6; Value2: 0.063W; AEC Qualified: Y; VDC_V: 50V; AEC Category: Q200; AEC Grade: 0; Supplier Part Number 2: 59M6696; Supplier 2: Newark; Supplier Part Number 3: 71-CRCW0402J-10K-E3; Supplier 3: Mouser; RoHS: E; Value1: 5%; MountType: SMT; Supplier 1: Digi-Key; PackageReference: 0402; Tolerance_%: 5%; Res_ohm: 10k; SizeArea_mm2: 0.5; CompType: Resistor; PartNumber: CRCW040210K0JNED; ComponentLink1Description: Datasheet link; Supplier Part Number 1: 541-10KJCT-ND; Technology: Thick Film; ComponentLink1URL: http://www.vishay.com/docs/20035/dcrcwe3.pdf
R88 = CMP-0025698-4: RES, 100 k, 5%, 0.1 W, AEC-Q200 Grade 0, 0603; Manufacturer: Vishay-Dale; Power_W: 100mW; TempCo: 200 ppm/C; Value: 100k; EIA_Code: E24; SizeX_mm: 1.6; SizeY_mm: 0.8; SizeZ_mm: 1; Value2: 0.1W; SizeArea_mm2: 1.28; AEC Qualified: Y; VDC_V: 75V; AEC Category: Q200; AEC Grade: 0; Supplier Part Number 2: 59M6763; Supplier 2: Newark; Supplier Part Number 3: 71-CRCW0603J-100K-E3; Supplier 3: Mouser; Value_Code: 100k; RoHS: E; Value1: 5%; MountType: SMT; Supplier 1: Digi-Key; PackageReference: 0603; Tolerance_%: 5%; Res_ohm: 100k; CompType: Resistor; PartNumber: CRCW0603100KJNEA; ComponentLink1Description: Datasheet link; Supplier Part Number 1: 541-100KGCT-ND; Technology: Thick Film; ComponentLink1URL: http://www.vishay.com/docs/20035/dcrcwe3.pdf
R89 = CMP-0026677-1: RES, 200 k, 1%, 0.1 W, 0402; Manufacturer: Panasonic; Power_W: 100mW; TempCo: 100 ppm/C; U/M: EA; Value: 200k; EIA_Code: E96; SizeX_mm: 1; SizeY_mm: 0.5; SizeZ_mm: 0.6; Value2: 0.1W; VDC_V: 50V; AEC Category: Q200; ComponentLink1URL: http://industrial.panasonic.com/www-data/pdf/AOA0000/AOA0000CE2.pdf; Supplier Part Number 2: 73T6488; Publisher: Texas Instruments; Supplier 2: Newark; Supplier Part Number 3: 667-ERJ-2RKF2003X; Supplier 3: Mouser; Published: 2008-06-26; Value_Code: 200k; RoHS: Y; Value1: 1%; MountType: SMT; Supplier 1: Digi-Key; PackageReference: 0402; Tolerance_%: 1%; Res_ohm: 200k; SizeArea_mm2: 0.5; CompType: Resistor; LatestRevisionDate: 2017-03-09; PartNumber: ERJ-2RKF2003X; AEC Qualified: ?; ComponentLink1Description: Datasheet link; Supplier Part Number 1: P200KLCT-ND; Technology: Thick Film
R90 = CMP-0025557-3: RES, 75.0 k, 0.5%, 0.1 W, 0603; Manufacturer: Yageo America; Power_W: 100mW; TempCo: 50 ppm/C; Value_Code: 75k0; U/M: EA; Value: 75.0k; EIA_Code: E192; Res_ohm: 75k; SizeX_mm: 1.6; SizeY_mm: 0.8; SizeZ_mm: 1; Value2: 0.1W; SizeArea_mm2: 1.28; VDC_V: 75V; AEC Category: Q200; Publisher: Texas Instruments; Published: 2008-06-26; RoHS: Y; Value1: 0.5%; MountType: SMT; PackageReference: 0603; Tolerance_%: 0.5%; CompType: Resistor; LatestRevisionDate: 2017-03-09; PartNumber: RT0603DRE0775KL; AEC Qualified: ?; ComponentLink1Description: Datasheet link; Technology: Thin Film; ComponentLink1URL: http://www.yageo.com/pdf/PYu-RT_1-to-0.05_RoHS_L_3.pdf
TP7-TP10 = CMP-0078143-2: TEST POINT.  No entry in BOM.; CompType: Testpoint; PackageReference: N/A; Manufacturer: N/A; PartNumber: N/A; Library Reference: TESTPOINT
U1 = CMP-0081777-3: TMS320F28388DZWTS, ZWT0337A (NFBGA-337); Manufacturer: Texas Instruments; SizeAreaWB_mm2: 324; SizeArea_mm2: 256; AEC Qualified: N; AEC Category: Q200; SizeZ_mm: 1.4; SizeY_mm: 16; CompType: IC; ComponentLink1Description: Datasheet Link; ComponentLink2Description: Product Folder; PackageReference: ZWT0337A; PartNumber: TMS320F28388DZWTS; PackageDescription: NFBGA-337; ComponentLink2URL: http://www.ti.com/product/tms320f28388d; Alternate Manufacturer: Texas Instruments; ComponentLink3URL: http://www.ti.com/product/tms320f28388d/datasheet; ComponentLink1URL: http://www.ti.com/lit/ds/symlink/tms320f28388d.pdf; MountType: SMT; ComponentLink3Description: Online Datasheet; SizeX_mm: 16
U14 = CMP-0037884-5: Dual, Adjustable, 600mA and 1000mA, 2.25MHz Step-Down Converter with 1-Wire Interface in QFN, DRC0010J (VSON-10); Manufacturer: Texas Instruments; Vin(Min)(V): 2.5; Regulated Outputs(#): 2; SizeY_mm: 3; Iout2(Max)(A): 1; Duty Cycle(Max)(%): 100; AEC Qualified: N; Dynamic Voltage Scaling: TRUE; Vout(Min)(V): 0.6; Vin(Max)(V): 6; Topology: Buck; SizeAreaWB_mm2: 16; CompType: IC; SizeArea_mm2: 9; Rating: Catalog; Iq(Typ)(mA): 0.032; AEC Category: Q200; PartNumber: TPS62420DRCR; ComponentLink1Description: Datasheet Link; PackageDescription: VSON-10; SizeZ_mm: 1; Operating Temperature Range: -40 to 85 C; SizeX_mm: 3; Vout2(Max)(V): 6; ComponentLink1URL: http://www.ti.com/lit/ds/symlink/tps62420.pdf; Switch Current Limit(Typ)(A): 1; PackageReference: DRC0010J; Vout2(Min)(V): 0.6; RoHS: Y; ComponentLink3URL: http://www.ti.com/product/tps62420/datasheet; Iout(Max)(A): 0.6; Synchronous Rectification: TRUE; Vout(Max)(V): 6; ComponentLink2Description: Product Folder; MountType: SMT; ComponentLink2URL: http://www.ti.com/product/tps62420; ComponentLink3Description: Online Datasheet